# EAGLE schematic Spartan6dev (EAGLE 5.06)
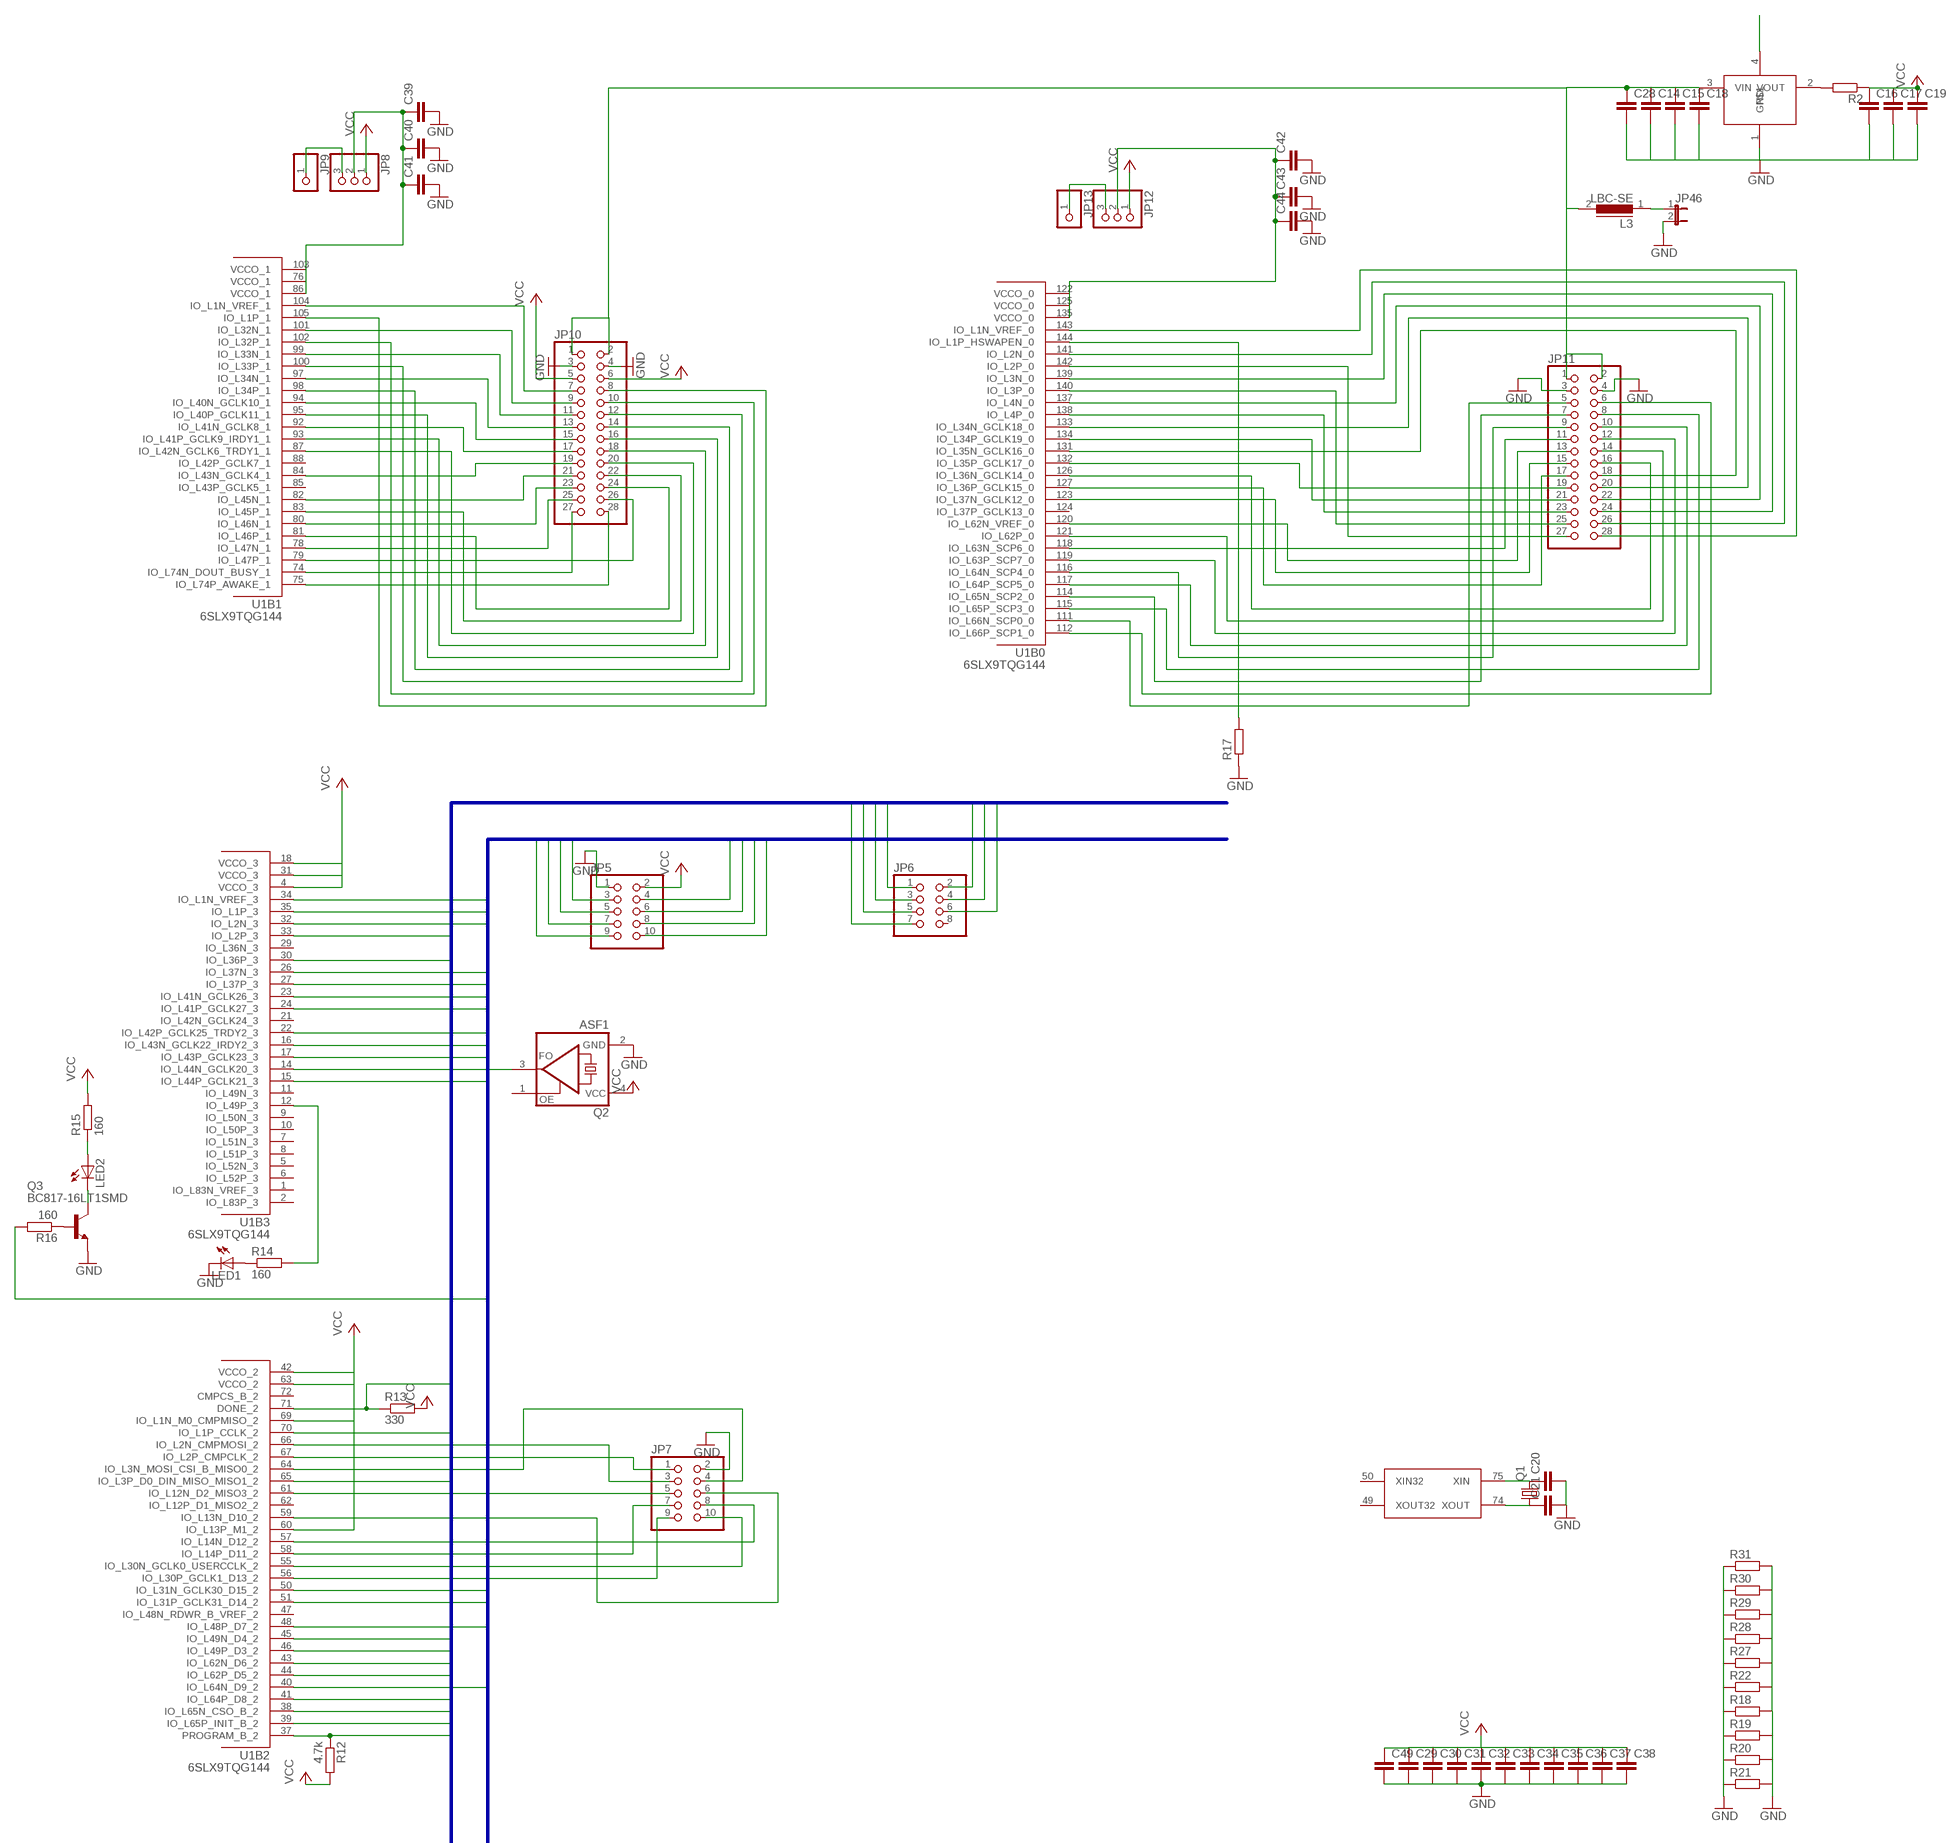
[diagram p0: schematic, sheet 1, part 1 of 3]
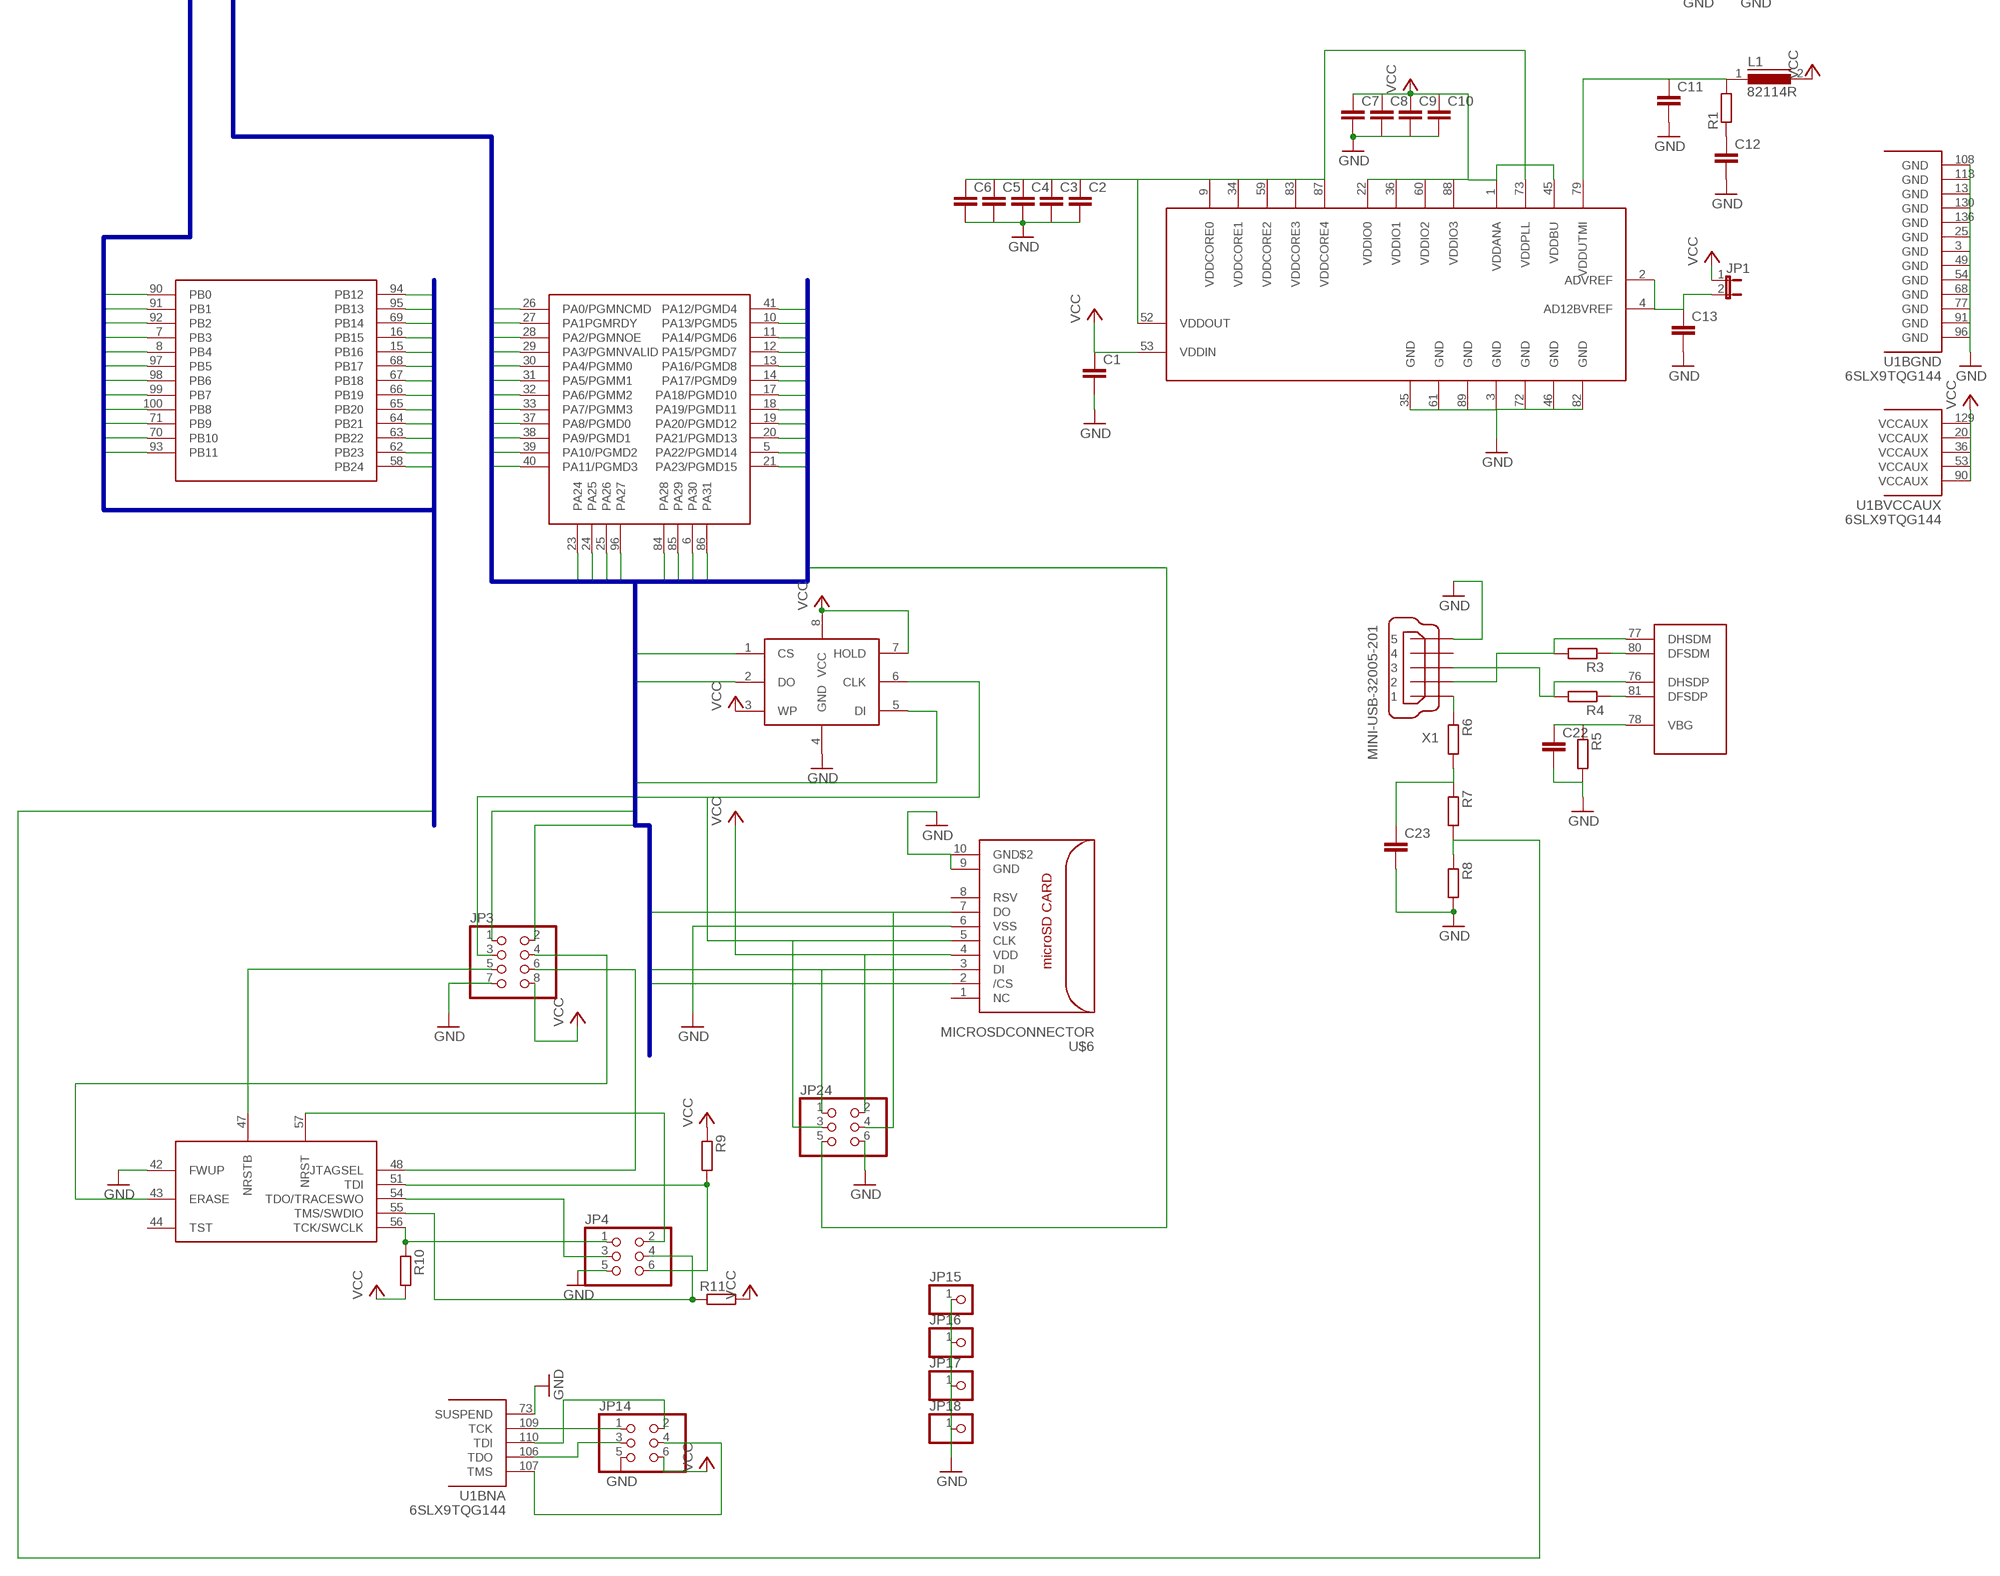
[diagram p1: schematic, sheet 1, part 2 of 3]
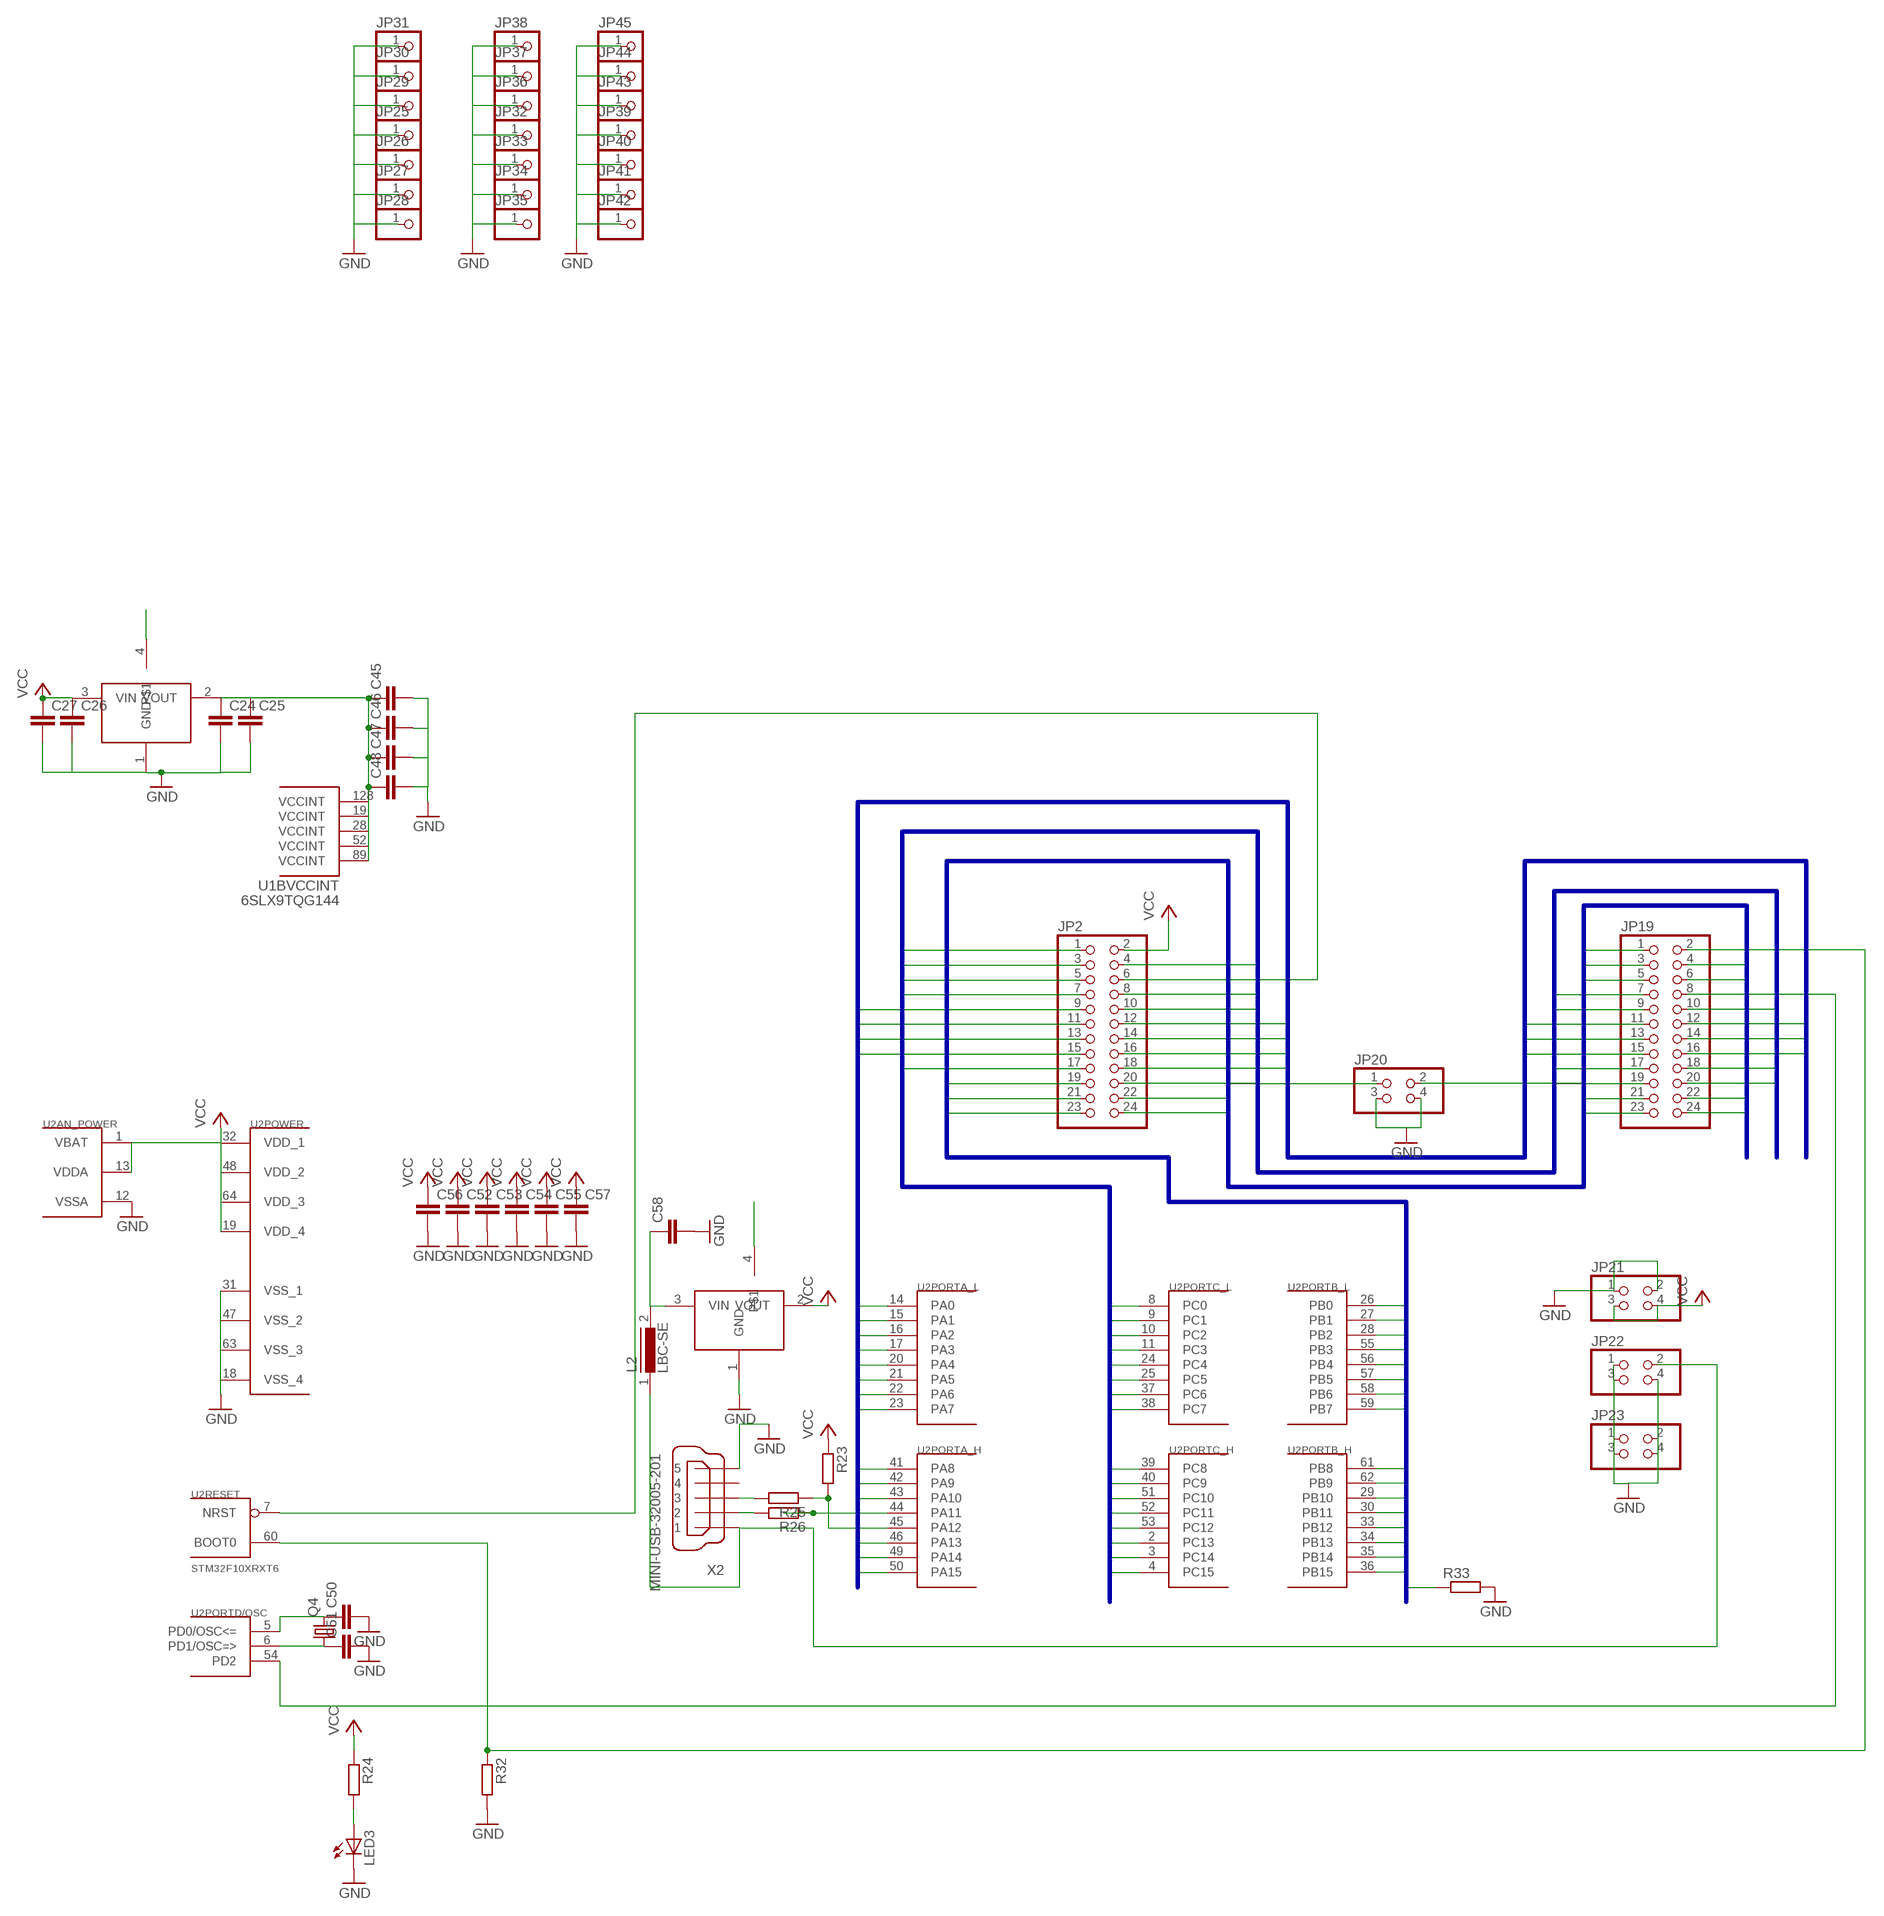
[diagram p2: schematic, sheet 1, part 3 of 3]

## Parts
C1  C-EUC0805  [C0805]
C2  C-EUC0805  [C0805]
C3  C-EUC0805  [C0805]
C4  C-EUC0805  [C0805]
C5  C-EUC0805  [C0805]
C6  C-EUC0805  [C0805]
C7  C-EUC0805  [C0805]
C8  C-EUC0805  [C0805]
C9  C-EUC0805  [C0805]
C10  C-EUC0805  [C0805]
C11  C-EUC1206  [C1206]
C12  C-EUC1206  [C1206]
C13  C-EUC0805  [C0805]
C14  C-EUC1812  [C1812]
C15  C-EUC1812  [C1812]
C16  C-EUC1812  [C1812]
C17  C-EUC1812  [C1812]
C18  C-EUC0805  [C0805]
C19  C-EUC0805  [C0805]
C20  C-EUC1206  [C1206]
C21  C-EUC1206  [C1206]
C22  C-EUC0805  [C0805]
C23  C-EUC0805  [C0805]
C24  C-EUC1812  [C1812]
C25  C-EUC0805  [C0805]
C26  C-EUC0805  [C0805]
C27  C-EUC1812  [C1812]
C28  C-EU025-050X050  [C025-050X050]
C29  C-EUC0805  [C0805]
C30  C-EUC0805  [C0805]
C31  C-EUC0805  [C0805]
C32  C-EUC0805  [C0805]
C33  C-EUC0805  [C0805]
C34  C-EUC0805  [C0805]
C35  C-EUC0805  [C0805]
C36  C-EUC0805  [C0805]
C37  C-EUC0805  [C0805]
C38  C-EUC0805  [C0805]
C39  C-EUC0805  [C0805]
C40  C-EUC0805  [C0805]
C41  C-EUC0805  [C0805]
C42  C-EUC0805  [C0805]
C43  C-EUC0805  [C0805]
C44  C-EUC0805  [C0805]
C45  C-EUC0805  [C0805]
C46  C-EUC0805  [C0805]
C47  C-EUC0805  [C0805]
C48  C-EUC0805  [C0805]
C49  C-EUC0805  [C0805]
C50  C-EUC1206  [C1206]
C51  C-EUC1206  [C1206]
C52  C-EUC0805  [C0805]
C53  C-EUC0805  [C0805]
C54  C-EUC0805  [C0805]
C55  C-EUC0805  [C0805]
C56  C-EUC1812  [C1812]
C57  C-EUC0805  [C0805]
C58  C-EUC0805  [C0805]
JP1  JP1E  [JP1]
JP2  PINHD-2X12  [2X12]
JP3  PINHD-2X4  [2X04]
JP4  PINHD-2X3  [2X03]
JP5  PINHD-2X5  [2X05]
JP6  PINHD-2X4  [2X04]
JP7  PINHD-2X5  [2X05]
JP8  PINHD-1X3  [1X03]
JP9  PINHD-1X1  [1X01]
JP10  PINHD-2X14  [2X14]
JP11  PINHD-2X14  [2X14]
JP12  PINHD-1X3  [1X03]
JP13  PINHD-1X1  [1X01]
JP14  PINHD-2X3  [2X03]
JP15  PINHD-1X1  [1X01]
JP16  PINHD-1X1  [1X01]
JP17  PINHD-1X1  [1X01]
JP18  PINHD-1X1  [1X01]
JP19  PINHD-2X12  [2X12]
JP20  PINHD-2X2  [2X02]
JP21  PINHD-2X2  [2X02]
JP22  PINHD-2X2  [2X02]
JP23  PINHD-2X2  [2X02]
JP24  PINHD-2X3  [2X03]
JP25  PINHD-1X1  [1X01]
JP26  PINHD-1X1  [1X01]
JP27  PINHD-1X1  [1X01]
JP28  PINHD-1X1  [1X01]
JP29  PINHD-1X1  [1X01]
JP30  PINHD-1X1  [1X01]
JP31  PINHD-1X1  [1X01]
JP32  PINHD-1X1  [1X01]
JP33  PINHD-1X1  [1X01]
JP34  PINHD-1X1  [1X01]
JP35  PINHD-1X1  [1X01]
JP36  PINHD-1X1  [1X01]
JP37  PINHD-1X1  [1X01]
JP38  PINHD-1X1  [1X01]
JP39  PINHD-1X1  [1X01]
JP40  PINHD-1X1  [1X01]
JP41  PINHD-1X1  [1X01]
JP42  PINHD-1X1  [1X01]
JP43  PINHD-1X1  [1X01]
JP44  PINHD-1X1  [1X01]
JP45  PINHD-1X1  [1X01]
JP46  JP1E  [JP1]
L1  82114R  [82114R]
L2  LBC-SE  [LBC-SE]
L3  LBC-SE  [LBC-SE]
LED1  LEDCHIP-LED0805  [CHIP-LED0805]
LED2  LEDCHIP-LED0805  [CHIP-LED0805]
LED3  LEDCHIP-LED0805  [CHIP-LED0805]
Q1  CRYSTALHC49S  [HC49/S]
Q2  ASF1  [ASF]
Q3  BC817-16LT1SMD  [SOT23-BEC]
Q4  CRYSTALHC49S  [HC49/S]
R1  R-EU_M1206  [M1206]
R2  R-EU_M1206  [M1206]
R3  R-EU_M1206  [M1206]
R4  R-EU_M1206  [M1206]
R5  R-EU_M1206  [M1206]
R6  R-EU_M1206  [M1206]
R7  R-EU_M1206  [M1206]
R8  R-EU_M1206  [M1206]
R9  R-EU_M1206  [M1206]
R10  R-EU_M1206  [M1206]
R11  R-EU_M1206  [M1206]
R12  4.7k  R-EU_M1206  [M1206]
R13  330  R-EU_M1206  [M1206]
R14  160  R-EU_M1206  [M1206]
R15  160  R-EU_M1206  [M1206]
R16  160  R-EU_M1206  [M1206]
R17  R-EU_R0805  [R0805]
R18  R-EU_R5025  [R5025]
R19  R-EU_R5025  [R5025]
R20  R-EU_R5025  [R5025]
R21  R-EU_R5025  [R5025]
R22  R-EU_R5025  [R5025]
R23  R-EU_R0805  [R0805]
R24  R-EU_R0805  [R0805]
R25  R-EU_R0805  [R0805]
R26  R-EU_R0805  [R0805]
R27  R-EU_R5025  [R5025]
R28  R-EU_R5025  [R5025]
R29  R-EU_R5025  [R5025]
R30  R-EU_R5025  [R5025]
R31  R-EU_R5025  [R5025]
R32  R-EU_R0805  [R0805]
R33  R-EU_R0805  [R0805]
U1  6SLX9TQG144  [TQ144]
U2  STM32F10XRXT6  [TQFP64]
U$1  SAM3U  [LQFP100]
U$2  LD1117  [SOT223]
U$3  W25Q80BV  [SOIC8]
U$4  LD1117  [SOT223]
U$5  LD1117  [SOT223]
U$6  MICROSDCONNECTOR  [MICROSDPAK]
X1  MINI-USB-32005-201  [32005-201]
X2  MINI-USB-32005-201  [32005-201]

## Nets
GND: C1.2 C2.2 C3.2 C4.2 C5.2 C6.2 C7.2 C8.2 C9.2 C10.2 C11.2 C12.2 C13.2 C14.2 C15.2 C16.2 C17.2 C18.2 C19.2 C20.2 C21.2 C22.2 C23.2 C24.2 C25.2 C26.2 C27.2 C28.2 C29.2 C30.2 C31.2 C32.2 C33.2 C34.2 C35.2 C36.2 C37.2 C38.2 C39.2 C40.2 C41.2 C42.2 C43.2 C44.2 C45.2 C46.2 C47.2 C48.2 C49.2 C50.2 C51.2 C52.2 C53.2 C54.2 C55.2 C56.2 C57.2 C58.2 JP3.7 JP4.5 JP5.1 JP7.2 JP10.3 JP10.4 JP11.3 JP11.4 JP14.5 JP15.1 JP16.1 JP17.1 JP18.1 JP20.3 JP20.4 JP21.1 JP21.2 JP22.1 JP22.3 JP22.4 JP23.1 JP23.2 JP23.3 JP23.4 JP24.6 JP25.1 JP26.1 JP27.1 JP28.1 JP29.1 JP30.1 JP31.1 JP32.1 JP33.1 JP34.1 JP35.1 JP36.1 JP37.1 JP38.1 JP39.1 JP40.1 JP41.1 JP42.1 JP43.1 JP44.1 JP45.1 JP46.2 LED1.C LED3.C Q2.2(GND) Q3.E R5.2 R8.2 R17.1 R18.1 R18.2 R19.1 R19.2 R20.1 R20.2 R21.1 R21.2 R22.1 R22.2 R27.1 R27.2 R28.1 R28.2 R29.1 R29.2 R30.1 R30.2 R31.1 R31.2 R32.2 R33.2 U1.3(BGND:GND) U1.13(BGND:GND) U1.25(BGND:GND) U1.49(BGND:GND) U1.54(BGND:GND) U1.68(BGND:GND) U1.73(BNA:SUSPEND) U1.77(BGND:GND) U1.91(BGND:GND) U1.96(BGND:GND) U1.108(BGND:GND) U1.113(BGND:GND) U1.130(BGND:GND) U1.136(BGND:GND) U2.12(AN_POWER:VSSA) U2.18(POWER:VSS_4) U2.31(POWER:VSS_1) U2.47(POWER:VSS_2) U2.63(POWER:VSS_3) U$1.3(GND) U$1.35(GND) U$1.42(FWUP) U$1.46(GND) U$1.61(GND) U$1.72(GND) U$1.82(GND) U$1.89(GND) U$2.1(GND) U$3.4(GND) U$4.1(GND) U$5.1(GND) U$6.6(VSS) U$6.9(GND) U$6.10(GND$2) X1.5 X2.5
N$1: C2.1 C3.1 C4.1 C5.1 C6.1 U$1.9(VDDCORE0) U$1.34(VDDCORE1) U$1.52(VDDOUT) U$1.59(VDDCORE2) U$1.73(VDDPLL) U$1.83(VDDCORE3) U$1.87(VDDCORE4)
N$2: C13.1 JP1.2 U$1.2(ADVREF) U$1.4(AD12BVREF)
N$3: R2.2 U$2.2(VOUT)
N$4: JP7.10 U1.55(B2:IO_L30N_GCLK0_USERCCLK_2)
N$5: JP7.9 U1.56(B2:IO_L30P_GCLK1_D13_2)
N$6: C12.1 R1.1
N$7: C11.1 L1.1 R1.2 U$1.79(VDDUTMI)
N$8: C14.1 C15.1 C18.1 C28.1 JP10.1 JP10.2 JP11.1 JP11.2 L3.2 U$2.3(VIN)
N$9: JP3.4 U$1.43(ERASE)
N$10: JP3.5 U$1.47(NRSTB)
N$11: JP3.6 U$1.48(JTAGSEL)
N$12: JP4.1 R10.1 U$1.56(TCK/SWCLK)
N$13: JP4.2 U$1.57(NRST)
N$14: C20.1 Q1.2 U$1.75(XIN)
N$15: C21.1 Q1.1 U$1.74(XOUT)
N$16: JP4.3 U$1.54(TDO/TRACESWO)
N$17: R3.1 U$1.80(DFSDM)
N$18: R4.1 U$1.81(DFSDP)
N$19: R3.2 U$1.77(DHSDM) X1.2
N$20: R4.2 U$1.76(DHSDP) X1.3
N$21: C22.1 R5.1 U$1.78(VBG)
N$22: R6.1 X1.1
N$23: C23.1 R6.2 R7.1
N$24: JP4.4 R11.1 U$1.55(TMS/SWDIO)
N$25: R26.1 U2.44(PORTA_H:PA11)
N$26: JP4.6 R9.2 U$1.51(TDI)
N$27: JP7.8 U1.57(B2:IO_L14N_D12_2)
N$28: JP7.7 U1.58(B2:IO_L14P_D11_2)
N$29: JP7.6 U1.59(B2:IO_L13N_D10_2)
N$30: JP7.5 U1.61(B2:IO_L12N_D2_MISO3_2)
N$31: JP7.4 U1.64(B2:IO_L3N_MOSI_CSI_B_MISO0_2)
N$32: JP7.3 U1.66(B2:IO_L2N_CMPMOSI_2)
N$33: C24.1 C25.1 C45.1 C46.1 C47.1 C48.1 U1.19(BVCCINT:VCCINT) U1.28(BVCCINT:VCCINT) U1.52(BVCCINT:VCCINT) U1.89(BVCCINT:VCCINT) U1.128(BVCCINT:VCCINT) U$4.2(VOUT)
N$34: C39.1 C40.1 C41.1 JP8.2 U1.76(B1:VCCO_1) U1.86(B1:VCCO_1) U1.103(B1:VCCO_1)
N$35: JP8.3 JP9.1
N$36: JP10.27 U1.74(B1:IO_L74N_DOUT_BUSY_1)
N$37: JP10.28 U1.75(B1:IO_L74P_AWAKE_1)
N$38: JP10.25 U1.78(B1:IO_L47N_1)
N$39: JP10.26 U1.79(B1:IO_L47P_1)
N$40: JP10.23 U1.80(B1:IO_L46N_1)
N$41: JP10.24 U1.81(B1:IO_L46P_1)
N$42: JP10.21 U1.82(B1:IO_L45N_1)
N$43: JP10.22 U1.83(B1:IO_L45P_1)
N$44: JP10.19 U1.84(B1:IO_L43N_GCLK4_1)
N$45: JP10.20 U1.87(B1:IO_L42N_GCLK6_TRDY1_1)
N$46: JP10.17 U1.92(B1:IO_L41N_GCLK8_1)
N$47: JP10.18 U1.93(B1:IO_L41P_GCLK9_IRDY1_1)
N$48: JP10.16 U1.95(B1:IO_L40P_GCLK11_1)
N$49: JP10.15 U1.94(B1:IO_L40N_GCLK10_1)
N$50: JP10.13 U1.97(B1:IO_L34N_1)
N$51: JP10.14 U1.98(B1:IO_L34P_1)
N$52: JP10.11 U1.99(B1:IO_L33N_1)
N$53: JP10.12 U1.100(B1:IO_L33P_1)
N$54: JP10.9 U1.101(B1:IO_L32N_1)
N$55: JP10.10 U1.102(B1:IO_L32P_1)
N$56: JP10.7 U1.104(B1:IO_L1N_VREF_1)
N$57: JP10.8 U1.105(B1:IO_L1P_1)
N$58: LED1.A R14.1
N$59: Q2.3(FO) U1.14(B3:IO_L44N_GCLK20_3)
N$60: R14.2 U1.12(B3:IO_L49P_3)
N$61: LED2.A R15.1
N$62: LED2.C Q3.C
N$63: Q3.B R16.1
N$64: C42.1 C43.1 C44.1 JP12.2 U1.122(B0:VCCO_0) U1.125(B0:VCCO_0) U1.135(B0:VCCO_0)
N$65: JP12.3 JP13.1
N$66: R17.2 U1.144(B0:IO_L1P_HSWAPEN_0)
N$67: JP11.28 U1.143(B0:IO_L1N_VREF_0)
N$68: JP11.27 U1.142(B0:IO_L2P_0)
N$69: JP11.26 U1.141(B0:IO_L2N_0)
N$70: JP11.25 U1.140(B0:IO_L3P_0)
N$71: JP11.24 U1.139(B0:IO_L3N_0)
N$72: JP11.23 U1.138(B0:IO_L4P_0)
N$73: JP11.22 U1.137(B0:IO_L4N_0)
N$74: JP11.21 U1.134(B0:IO_L34P_GCLK19_0)
N$75: JP11.20 U1.133(B0:IO_L34N_GCLK18_0)
N$76: JP11.19 U1.132(B0:IO_L35P_GCLK17_0)
N$77: JP11.18 U1.131(B0:IO_L35N_GCLK16_0)
N$78: JP11.17 U1.127(B0:IO_L36P_GCLK15_0)
N$79: JP11.16 U1.126(B0:IO_L36N_GCLK14_0)
N$80: JP11.15 U1.123(B0:IO_L37N_GCLK12_0)
N$81: JP11.14 U1.121(B0:IO_L62P_0)
N$82: JP11.13 U1.120(B0:IO_L62N_VREF_0)
N$83: JP11.12 U1.119(B0:IO_L63P_SCP7_0)
N$84: JP11.11 U1.118(B0:IO_L63N_SCP6_0)
N$85: JP11.10 U1.117(B0:IO_L64P_SCP5_0)
N$86: JP11.9 U1.116(B0:IO_L64N_SCP4_0)
N$87: JP11.8 U1.115(B0:IO_L65P_SCP3_0)
N$88: JP11.7 U1.114(B0:IO_L65N_SCP2_0)
N$89: JP11.6 U1.112(B0:IO_L66P_SCP1_0)
N$90: JP11.5 U1.111(B0:IO_L66N_SCP0_0)
N$91: JP14.1 U1.109(BNA:TCK)
N$92: JP14.3 U1.106(BNA:TDO)
N$93: JP14.4 U1.107(BNA:TMS)
N$94: R23.2 R25.1 U2.45(PORTA_H:PA12)
N$95: JP22.2 L2.1 X2.1
N$96: R25.2 X2.3
N$97: C50.1 Q4.2 U2.5(PORTD/OSC:PD0/OSC<=)
N$98: C51.1 Q4.1 U2.6(PORTD/OSC:PD1/OSC=>)
N$99: JP2.6 U2.7(RESET:NRST)
N$100: JP19.8 U2.54(PORTD/OSC:PD2)
N$101: JP19.2 R32.1 U2.60(RESET:BOOT0)
N$102: R26.2 X2.2
N$103: JP14.2 U1.110(BNA:TDI)
N$104: JP7.1 U1.67(B2:IO_L2P_CMPCLK_2)
N$105: LED3.A R24.2
N$106: C58.1 L2.2 U$5.3(VIN)
N$107: JP46.1 L3.1
P$1: U$2.4
P$2: U$4.4
P$3: U$5.4
PA0: U$1.26(PA0/PGMNCMD) U$6.2(/CS)
PA1: JP5.9 JP24.5 U$1.27(PA1PGMRDY)
PA2: JP5.7 U$1.28(PA2/PGMNOE)
PA3: JP5.5 U$1.29(PA3/PGMNVALID)
PA4: JP5.3 U$1.30(PA4/PGMM0)
PA5: JP5.4 U$1.31(PA5/PGMM1)
PA6: JP5.6 U$1.32(PA6/PGMM2)
PA7: JP5.8 U$1.33(PA7/PGMM3)
PA8: JP5.10 U$1.37(PA8/PGMD0)
PA9: U$1.38(PA9/PGMD1)
PA10: JP3.1 U$1.39(PA10/PGMD2)
PA11: JP3.2 U$1.40(PA11/PGMD3)
PA12: JP3.3 U$1.41(PA12/PGMD4)
PA13: JP24.4 U$1.10(PA13/PGMD5) U$3.2(DO) U$6.7(DO)
PA14: JP24.1 U$1.11(PA14/PGMD6) U$3.5(DI) U$6.3(DI)
PA15: JP24.3 U$1.12(PA15/PGMD7) U$3.6(CLK) U$6.5(CLK)
PA16: U$1.13(PA16/PGMD8) U$3.1(CS)
PA17: U1.32(B3:IO_L2N_3) U$1.14(PA17/PGMD9)
PA18: U1.27(B3:IO_L37P_3) U$1.17(PA18/PGMD10)
PA19: U1.26(B3:IO_L37N_3) U$1.18(PA19/PGMD11)
PA20: U1.24(B3:IO_L41P_GCLK27_3) U$1.19(PA20/PGMD12)
PA21: U1.23(B3:IO_L41N_GCLK26_3) U$1.20(PA21/PGMD13)
PA22: U1.35(B3:IO_L1P_3) U$1.5(PA22/PGMD14)
PA23: U1.22(B3:IO_L42P_GCLK25_TRDY2_3) U$1.21(PA23/PGMD15)
PA24: U1.17(B3:IO_L43P_GCLK23_3) U$1.23(PA24)
PA25: R16.2 U1.16(B3:IO_L43N_GCLK22_IRDY2_3) U$1.24(PA25)
PA26: U1.15(B3:IO_L44P_GCLK21_3) U$1.25(PA26)
PA27: U1.40(B2:IO_L64N_D9_2) U$1.96(PA27)
PA28: U1.51(B2:IO_L31P_GCLK31_D14_2) U$1.84(PA28)
PA29: U1.50(B2:IO_L31N_GCLK30_D15_2) U$1.85(PA29)
PA30: U1.34(B3:IO_L1N_VREF_3) U$1.6(PA30)
PA31: U1.48(B2:IO_L48P_D7_2) U$1.86(PA31)
PB0: U1.46(B2:IO_L49P_D3_2) U$1.90(PB0)
PB1: U1.45(B2:IO_L49N_D4_2) U$1.91(PB1)
PB2: U1.44(B2:IO_L62P_D5_2) U$1.92(PB2)
PB3: U1.33(B3:IO_L2P_3) U$1.7(PB3)
PB4: U$1.8(PB4)
PB5: U1.39(B2:IO_L65P_INIT_B_2) U$1.97(PB5)
PB6: U1.38(B2:IO_L65N_CSO_B_2) U$1.98(PB6)
PB7: R12.1 U1.37(B2:PROGRAM_B_2) U$1.99(PB7)
PB8: U$1.100(PB8)
PB9: R7.2 R8.1 U$1.71(PB9)
PB10: U1.65(B2:IO_L3P_D0_DIN_MISO_MISO1_2) U$1.70(PB10)
PB11: U1.43(B2:IO_L62N_D6_2) U$1.93(PB11)
PB12: U1.41(B2:IO_L64P_D8_2) U$1.94(PB12)
PB13: U$1.95(PB13)
PB14: U1.70(B2:IO_L1P_CCLK_2) U$1.69(PB14)
PB15: U1.30(B3:IO_L36P_3) U$1.16(PB15)
PB16: U$1.15(PB16)
PB17: R13.1 U1.71(B2:DONE_2) U$1.68(PB17)
PB18: JP6.7 U$1.67(PB18)
PB19: JP6.6 U$1.66(PB19)
PB20: JP6.5 U$1.65(PB20)
PB21: JP6.4 U$1.64(PB21)
PB22: JP6.3 U$1.63(PB22)
PB23: JP6.2 U$1.62(PB23)
PB24: JP6.1 U$1.58(PB24)
SPA0: JP2.9 U2.14(PORTA_L:PA0)
SPA1: JP2.12 U2.15(PORTA_L:PA1)
SPA2: JP2.11 U2.16(PORTA_L:PA2)
SPA3: JP2.14 U2.17(PORTA_L:PA3)
SPA4: JP2.13 U2.20(PORTA_L:PA4)
SPA5: JP2.16 U2.21(PORTA_L:PA5)
SPA6: JP2.15 U2.22(PORTA_L:PA6)
SPA7: JP2.18 U2.23(PORTA_L:PA7)
SPA8: JP19.16 U2.41(PORTA_H:PA8)
SPA9: JP19.15 U2.42(PORTA_H:PA9)
SPA10: JP19.14 U2.43(PORTA_H:PA10)
SPA13: JP19.13 U2.46(PORTA_H:PA13)
SPA14: JP19.11 U2.49(PORTA_H:PA14)
SPA15: JP19.12 U2.50(PORTA_H:PA15)
SPB0: JP2.19 U2.26(PORTB_L:PB0)
SPB1: JP2.22 U2.27(PORTB_L:PB1)
SPB2: JP2.21 R33.1 U2.28(PORTB_L:PB2)
SPB3: JP19.5 U2.55(PORTB_L:PB3)
SPB4: JP19.6 U2.56(PORTB_L:PB4)
SPB5: JP19.3 U2.57(PORTB_L:PB5)
SPB6: JP19.4 U2.58(PORTB_L:PB6)
SPB7: JP19.1 U2.59(PORTB_L:PB7)
SPB8: JP20.2 U2.61(PORTB_H:PB8)
SPB9: JP20.1 U2.62(PORTB_H:PB9)
SPB10: JP2.24 U2.29(PORTB_H:PB10)
SPB11: JP2.23 U2.30(PORTB_H:PB11)
SPB12: JP19.24 U2.33(PORTB_H:PB12)
SPB13: JP19.23 U2.34(PORTB_H:PB13)
SPB14: JP19.22 U2.35(PORTB_H:PB14)
SPB15: JP19.21 U2.36(PORTB_H:PB15)
SPC0: JP2.5 U2.8(PORTC_L:PC0)
SPC1: JP2.8 U2.9(PORTC_L:PC1)
SPC2: JP2.7 U2.10(PORTC_L:PC2)
SPC3: JP2.10 U2.11(PORTC_L:PC3)
SPC4: JP2.17 U2.24(PORTC_L:PC4)
SPC5: JP2.20 U2.25(PORTC_L:PC5)
SPC6: JP19.20 U2.37(PORTC_L:PC6)
SPC7: JP19.19 U2.38(PORTC_L:PC7)
SPC8: JP19.18 U2.39(PORTC_H:PC8)
SPC9: JP19.17 U2.40(PORTC_H:PC9)
SPC10: JP19.9 U2.51(PORTC_H:PC10)
SPC11: JP19.10 U2.52(PORTC_H:PC11)
SPC12: JP19.7 U2.53(PORTC_H:PC12)
SPC13: JP2.1 U2.2(PORTC_H:PC13)
SPC14: JP2.4 U2.3(PORTC_H:PC14)
SPC15: JP2.3 U2.4(PORTC_H:PC15)
VCC: C1.1 C7.1 C8.1 C9.1 C10.1 C16.1 C17.1 C19.1 C26.1 C27.1 C29.1 C30.1 C31.1 C32.1 C33.1 C34.1 C35.1 C36.1 C37.1 C38.1 C49.1 C52.1 C53.1 C54.1 C55.1 C56.1 C57.1 JP1.1 JP2.2 JP3.8 JP5.2 JP8.1 JP10.5 JP10.6 JP12.1 JP14.6 JP21.3 JP21.4 JP24.2 L1.2 Q2.4(VCC) R2.1 R9.1 R10.2 R11.2 R12.2 R13.2 R15.2 R23.1 R24.1 U1.4(B3:VCCO_3) U1.18(B3:VCCO_3) U1.20(BVCCAUX:VCCAUX) U1.31(B3:VCCO_3) U1.36(BVCCAUX:VCCAUX) U1.42(B2:VCCO_2) U1.53(BVCCAUX:VCCAUX) U1.60(B2:IO_L13P_M1_2) U1.63(B2:VCCO_2) U1.69(B2:IO_L1N_M0_CMPMISO_2) U1.90(BVCCAUX:VCCAUX) U1.129(BVCCAUX:VCCAUX) U2.1(AN_POWER:VBAT) U2.13(AN_POWER:VDDA) U2.19(POWER:VDD_4) U2.32(POWER:VDD_1) U2.48(POWER:VDD_2) U2.64(POWER:VDD_3) U$1.1(VDDANA) U$1.22(VDDIO0) U$1.36(VDDIO1) U$1.45(VDDBU) U$1.53(VDDIN) U$1.60(VDDIO2) U$1.88(VDDIO3) U$3.3(WP) U$3.7(HOLD) U$3.8(VCC) U$4.3(VIN) U$5.2(VOUT) U$6.4(VDD)
Unconnected: JP6.8 Q2.1(OE) U1.1(B3:IO_L83N_VREF_3) U1.2(B3:IO_L83P_3) U1.5(B3:IO_L52N_3) U1.6(B3:IO_L52P_3) U1.7(B3:IO_L51N_3) U1.8(B3:IO_L51P_3) U1.9(B3:IO_L50N_3) U1.10(B3:IO_L50P_3) U1.11(B3:IO_L49N_3) U1.21(B3:IO_L42N_GCLK24_3) U1.29(B3:IO_L36N_3) U1.47(B2:IO_L48N_RDWR_B_VREF_2) U1.62(B2:IO_L12P_D1_MISO2_2) U1.72(B2:CMPCS_B_2) U1.85(B1:IO_L43P_GCLK5_1) U1.88(B1:IO_L42P_GCLK7_1) U1.124(B0:IO_L37P_GCLK13_0) U$1.44(TST) U$1.49(XOUT32) U$1.50(XIN32) U$6.1(NC) U$6.8(RSV) X1.4 X2.4

## Buses
PB[0..24]
PA[0..31]
SPA[0..15]
SPC[0..15]
SPB[0..15]

## Library data of the parts
C1-C13 C18 C19 C22 C23 C25 C26 C29-C49 C52-C55 C57 C58 = resistor:C-EU: CAPACITOR, European symbol
C14-C17 C20 C21 C24 C27 C28 C50 C51 C56 = rcl:C-EU: CAPACITOR, European symbol
JP1 JP46 = jumper:JP1E: JUMPER
JP2 JP19 = pinhead:PINHD-2X12: PIN HEADER
JP3 JP6 = pinhead:PINHD-2X4: PIN HEADER
JP4 JP14 JP24 = pinhead:PINHD-2X3: PIN HEADER
JP5 JP7 = pinhead:PINHD-2X5: PIN HEADER
JP8 JP12 = pinhead:PINHD-1X3: PIN HEADER
JP9 JP13 JP15-JP18 JP25-JP45 = pinhead:PINHD-1X1: PIN HEADER
JP10 JP11 = pinhead:PINHD-2X14: PIN HEADER
JP20-JP23 = pinhead:PINHD-2X2: PIN HEADER
L1 = inductors:82114R: INDUCTOR
L2 L3 = inductors:LBC-SE: INDUCTOR
LED1-LED3 = led:LED: LED OSRAM: - CHIPLED LG R971, LG N971, LY N971, LG Q971, LY Q971, LO R971, LY R971 LH N974, LH R974 LS Q976, LO Q976, LY Q976 LO Q996 - Hyper CHIPLED LW Q18S LB Q993, LB Q99A, LB R99A - SideLED LS A670, LO A670, LY A670, LG A670, LP A670 LB A673, LV A673, LT A673, LW A673 LH A674 LY A675 LS A676, LA A676, LO A676, LY A676, LW A676 LS A679, LY A679, LG A679 - Hyper Micro SIDELED® LS Y876, LA Y876, LO Y876, LY Y876 LT Y87S - SmartLED LW L88C, LW L88S LB L89C, LB L89S, LG L890 LS L89K, LO L89K, LY L89K LS L896, LA L896, LO L896, LY L896 - TOPLED LS T670, LO T670, LY T670, LG T670, LP T670 LSG T670, LSP T670, LSY T670, LOP T670, LYG T670 LG T671, LOG T671, LSG T671 LB T673, LV T673, LT T673, LW T673 LH T674 LS T676, LA T676, LO T676, LY T676, LB T676, LH T676, LSB T676, LW T676 LB T67C, LV T67C, LT T67C, LS T67K, LO T67K, LY T67K, LW E67C LS E67B, LA E67B, LO E67B, LY E67B, LB E67C, LV E67C, LT E67C LW T67C LS T679, LY T679, LG T679 LS T770, LO T770, LY T770, LG T770, LP T770 LB T773, LV T773, LT T773, LW T773 LH T774 LS E675, LA E675, LY E675, LS T675 LS T776, LA T776, LO T776, LY T776, LB T776 LHGB T686 LT T68C, LB T68C - Hyper Mini TOPLED® LB M676 - Mini TOPLED Santana® LG M470 LS M47K, LO M47K, LY M47K Source: http://www.osram.convergy.de LUXEON: - LUMILED® LXK2-PW12-R00, LXK2-PW12-S00, LXK2-PW14-U00, LXK2-PW14-V00 LXK2-PM12-R00, LXK2-PM12-S00, LXK2-PM14-U00 LXK2-PE12-Q00, LXK2-PE12-R00, LXK2-PE12-S00, LXK2-PE14-T00, LXK2-PE14-U00 LXK2-PB12-K00, LXK2-PB12-L00, LXK2-PB12-M00, LXK2-PB14-N00, LXK2-PB14-P00, LXK2-PB14-Q00 LXK2-PR12-L00, LXK2-PR12-M00, LXK2-PR14-Q00, LXK2-PR14-R00 LXK2-PD12-Q00, LXK2-PD12-R00, LXK2-PD12-S00 LXK2-PH12-R00, LXK2-PH12-S00 LXK2-PL12-P00, LXK2-PL12-Q00, LXK2-PL12-R00 Source: www.luxeon.com KINGBRIGHT: KA-3528ASYC Source: www.kingbright.com
Q1 Q4 = crystal:CRYSTAL: CRYSTAL
Q2 = crystal:ASF*: CRYSTAL CLOCK OSCILLATORS 5.0 Vdc or 3.3 Vdc - LOW PROFILE ULTRA MINIATURE CERAMIC SURFACE MOUNT Source: http://www.abracon.com/Oscillators/asf1-L-L1.pdf
Q3 = transistor-npn:BC817*: NPN Transistor
R1-R16 = resistor:R-EU_: RESISTOR, European symbol
R17-R33 = rcl:R-EU_: RESISTOR, European symbol
U1 = xilinx_devices:6SLX9TQG144: Xilinx FPGA: 6SLX9TQG144
U2 = stm32:STM32F10XRXT6: STM32F101/103 64pin LQFP
U$1 = tommilib:SAM3U
U$2 U$4 U$5 = tommilib:LD1117
U$3 = tommilib:W25Q80BV
U$6 = tommilib:MICROSDCONNECTOR
X1 X2 = con-cypressindustries:MINI-USB-: MINI USB-B Conector Source: www.cypressindustries.com